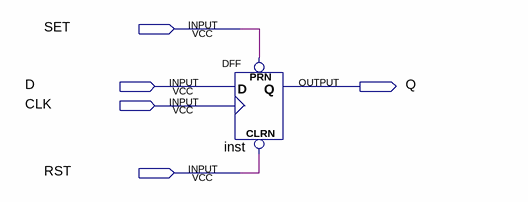
[diagram p0: schematic sheet]
// Quartus schematic DFF_test.bdf as structural Verilog: 1 symbols, 5 pins
module DFF_test (
  input  SET,
  input  D,
  input  CLK,
  input  RST,
  output Q
);

  DFF inst (.CLRN(RST), .CLK(CLK), .D(D), .PRN(SET), .Q(Q));
endmodule
